# EAGLE design km11 (EAGLE 6.6.0)
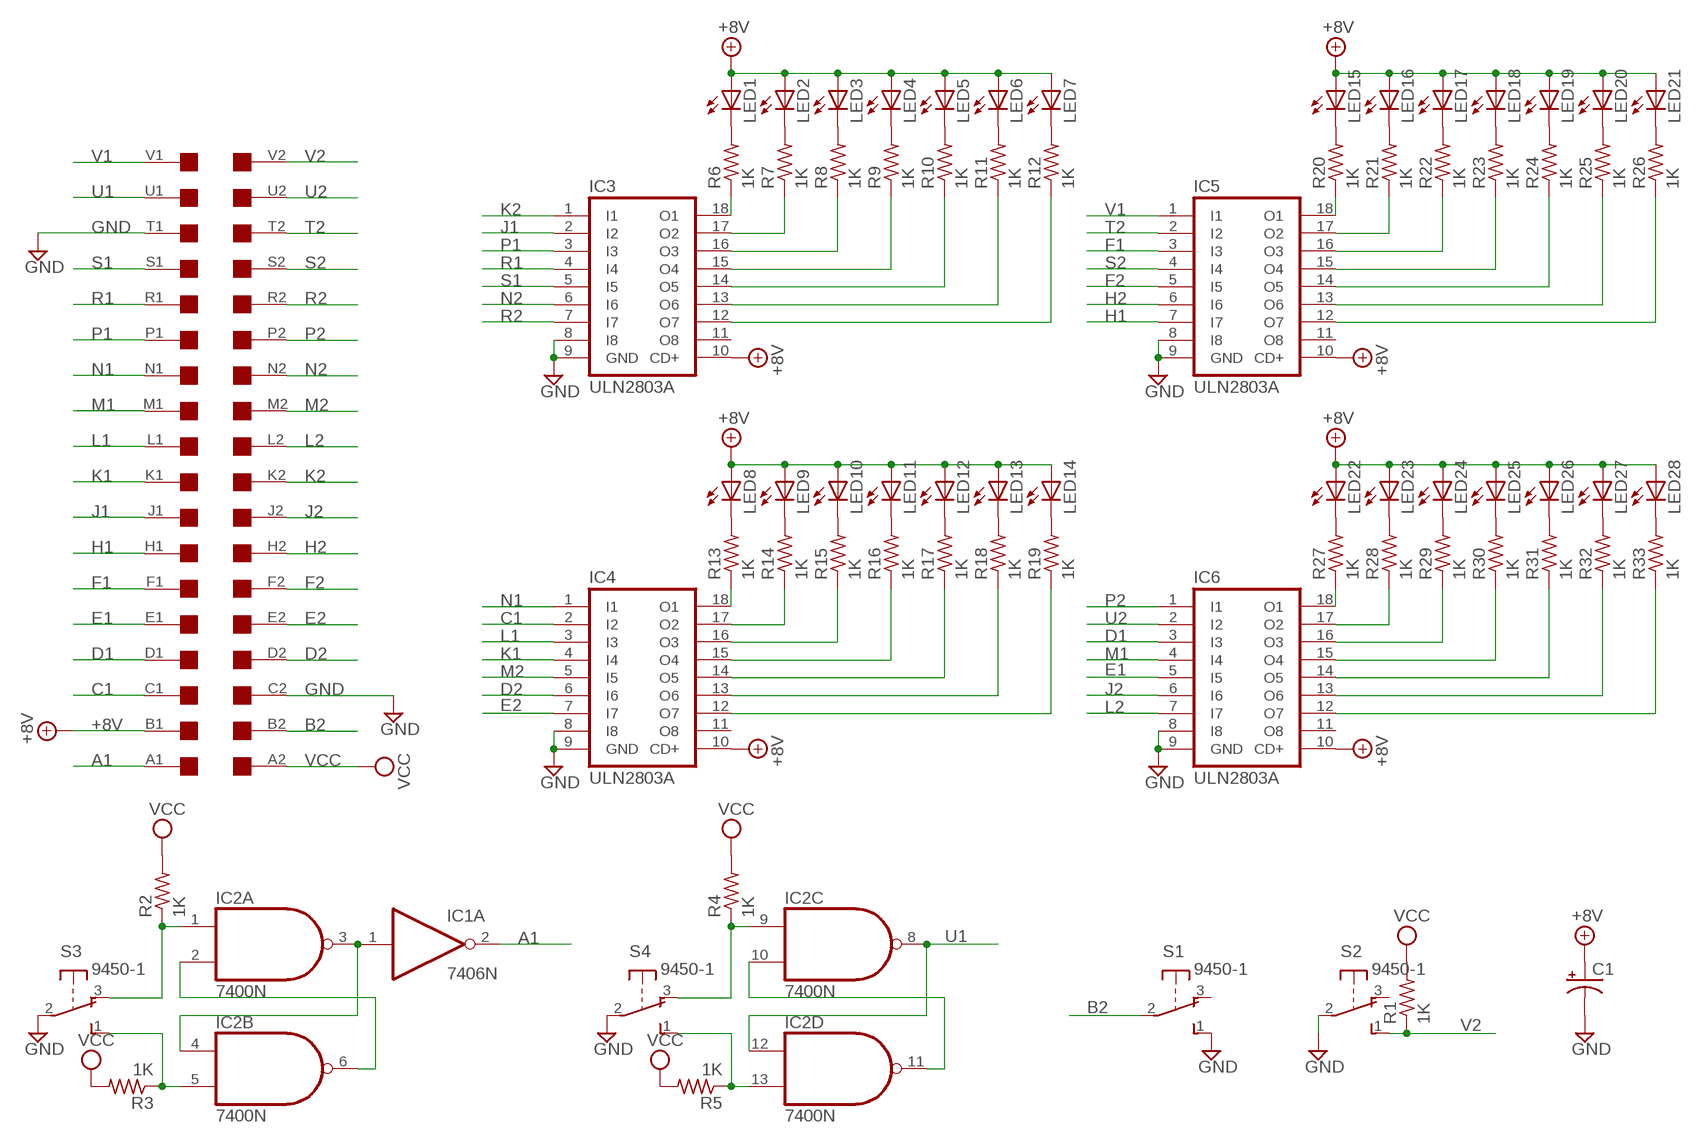
[diagram p0: schematic, sheet 1]

## Parts
C1  CPOL-USE22-6AXIAL  [E22-6]
IC1  7406N  [DIL14]
IC2  7400N  [DIL14]
IC3  ULN2803A  [DIL18]
IC4  ULN2803A  [DIL18]
IC5  ULN2803A  [DIL18]
IC6  ULN2803A  [DIL18]
LED1  LED3MM  [LED3MM]
LED2  LED3MM  [LED3MM]
LED3  LED3MM  [LED3MM]
LED4  LED3MM  [LED3MM]
LED5  LED3MM  [LED3MM]
LED6  LED3MM  [LED3MM]
LED7  LED3MM  [LED3MM]
LED8  LED3MM  [LED3MM]
LED9  LED3MM  [LED3MM]
LED10  LED3MM  [LED3MM]
LED11  LED3MM  [LED3MM]
LED12  LED3MM  [LED3MM]
LED13  LED3MM  [LED3MM]
LED14  LED3MM  [LED3MM]
LED15  LED3MM  [LED3MM]
LED16  LED3MM  [LED3MM]
LED17  LED3MM  [LED3MM]
LED18  LED3MM  [LED3MM]
LED19  LED3MM  [LED3MM]
LED20  LED3MM  [LED3MM]
LED21  LED3MM  [LED3MM]
LED22  LED3MM  [LED3MM]
LED23  LED3MM  [LED3MM]
LED24  LED3MM  [LED3MM]
LED25  LED3MM  [LED3MM]
LED26  LED3MM  [LED3MM]
LED27  LED3MM  [LED3MM]
LED28  LED3MM  [LED3MM]
R1  1K  R-US_0207/10  [0207/10]
R2  1K  R-US_0207/10  [0207/10]
R3  1K  R-US_0207/10  [0207/10]
R4  1K  R-US_0207/10  [0207/10]
R5  1K  R-US_0207/10  [0207/10]
R6  1K  R-US_0207/10  [0207/10]
R7  1K  R-US_0207/10  [0207/10]
R8  1K  R-US_0207/10  [0207/10]
R9  1K  R-US_0207/10  [0207/10]
R10  1K  R-US_0207/10  [0207/10]
R11  1K  R-US_0207/10  [0207/10]
R12  1K  R-US_0207/10  [0207/10]
R13  1K  R-US_0207/10  [0207/10]
R14  1K  R-US_0207/10  [0207/10]
R15  1K  R-US_0207/10  [0207/10]
R16  1K  R-US_0207/10  [0207/10]
R17  1K  R-US_0207/10  [0207/10]
R18  1K  R-US_0207/10  [0207/10]
R19  1K  R-US_0207/10  [0207/10]
R20  1K  R-US_0207/10  [0207/10]
R21  1K  R-US_0207/10  [0207/10]
R22  1K  R-US_0207/10  [0207/10]
R23  1K  R-US_0207/10  [0207/10]
R24  1K  R-US_0207/10  [0207/10]
R25  1K  R-US_0207/10  [0207/10]
R26  1K  R-US_0207/10  [0207/10]
R27  1K  R-US_0207/10  [0207/10]
R28  1K  R-US_0207/10  [0207/10]
R29  1K  R-US_0207/10  [0207/10]
R30  1K  R-US_0207/10  [0207/10]
R31  1K  R-US_0207/10  [0207/10]
R32  1K  R-US_0207/10  [0207/10]
R33  1K  R-US_0207/10  [0207/10]
S1  9450-1  [9450-1]
S2  9450-1  [9450-1]
S3  9450-1  [9450-1]
S4  9450-1  [9450-1]
U$1  EDGE-2CONNECTOR  [EDGE-CON2]

## Nets
+8V: C1.+ IC3.10(CD+) IC4.10(CD+) IC5.10(CD+) IC6.10(CD+) LED1.A LED2.A LED3.A LED4.A LED5.A LED6.A LED7.A LED8.A LED9.A LED10.A LED11.A LED12.A LED13.A LED14.A LED15.A LED16.A LED17.A LED18.A LED19.A LED20.A LED21.A LED22.A LED23.A LED24.A LED25.A LED26.A LED27.A LED28.A U$1.B1
A1: IC1.2(A:O) U$1.A1
B2: S1.2(P) U$1.B2
C1: IC4.2(I2) U$1.C1
D1: IC6.3(I3) U$1.D1
D2: IC4.6(I6) U$1.D2
E1: IC6.5(I5) U$1.E1
E2: IC4.7(I7) U$1.E2
F1: IC5.3(I3) U$1.F1
F2: IC5.5(I5) U$1.F2
GND: C1.- IC3.8(I8) IC3.9(GND) IC4.8(I8) IC4.9(GND) IC5.8(I8) IC5.9(GND) IC6.8(I8) IC6.9(GND) S1.1(S) S2.2(P) S3.2(P) S4.2(P) U$1.C2 U$1.T1
H1: IC5.7(I7) U$1.H1
H2: IC5.6(I6) U$1.H2
J1: IC3.2(I2) U$1.J1
J2: IC6.6(I6) U$1.J2
K1: IC4.4(I4) U$1.K1
K2: IC3.1(I1) U$1.K2
L1: IC4.3(I3) U$1.L1
L2: IC6.7(I7) U$1.L2
M1: IC6.4(I4) U$1.M1
M2: IC4.5(I5) U$1.M2
N1: IC4.1(I1) U$1.N1
N2: IC3.6(I6) U$1.N2
N$1: IC1.1(A:I) IC2.3(A:O) IC2.4(B:I0)
N$2: IC2.2(A:I1) IC2.6(B:O)
N$3: IC2.5(B:I1) R3.1 S3.1(S)
N$4: IC2.1(A:I0) R2.1 S3.3(O)
N$5: LED1.K(C) R6.2
N$6: IC2.10(C:I1) IC2.11(D:O)
N$7: IC2.13(D:I1) R5.1 S4.1(S)
N$8: IC2.9(C:I0) R4.1 S4.3(O)
N$9: IC3.18(O1) R6.1
N$10: LED2.K(C) R7.2
N$11: LED3.K(C) R8.2
N$12: LED4.K(C) R9.2
N$13: LED5.K(C) R10.2
N$14: LED6.K(C) R11.2
N$15: LED7.K(C) R12.2
N$16: IC3.17(O2) R7.1
N$17: IC3.16(O3) R8.1
N$18: IC3.15(O4) R9.1
N$19: IC3.14(O5) R10.1
N$20: IC3.13(O6) R11.1
N$21: IC3.12(O7) R12.1
N$29: LED8.K(C) R13.2
N$30: IC4.18(O1) R13.1
N$31: LED9.K(C) R14.2
N$32: LED10.K(C) R15.2
N$33: LED11.K(C) R16.2
N$34: LED12.K(C) R17.2
N$35: LED13.K(C) R18.2
N$36: LED14.K(C) R19.2
N$37: IC4.17(O2) R14.1
N$38: IC4.16(O3) R15.1
N$39: IC4.15(O4) R16.1
N$40: IC4.14(O5) R17.1
N$41: IC4.13(O6) R18.1
N$42: IC4.12(O7) R19.1
N$43: LED15.K(C) R20.2
N$44: IC5.18(O1) R20.1
N$45: LED16.K(C) R21.2
N$46: LED17.K(C) R22.2
N$47: LED18.K(C) R23.2
N$48: LED19.K(C) R24.2
N$49: LED20.K(C) R25.2
N$50: LED21.K(C) R26.2
N$51: IC5.17(O2) R21.1
N$52: IC5.16(O3) R22.1
N$53: IC5.15(O4) R23.1
N$54: IC5.14(O5) R24.1
N$55: IC5.13(O6) R25.1
N$56: IC5.12(O7) R26.1
N$57: LED22.K(C) R27.2
N$58: IC6.18(O1) R27.1
N$59: LED23.K(C) R28.2
N$60: LED24.K(C) R29.2
N$61: LED25.K(C) R30.2
N$62: LED26.K(C) R31.2
N$63: LED27.K(C) R32.2
N$64: LED28.K(C) R33.2
N$65: IC6.17(O2) R28.1
N$66: IC6.16(O3) R29.1
N$67: IC6.15(O4) R30.1
N$68: IC6.14(O5) R31.1
N$69: IC6.13(O6) R32.1
N$70: IC6.12(O7) R33.1
P1: IC3.3(I3) U$1.P1
P2: IC6.1(I1) U$1.P2
R1: IC3.4(I4) U$1.R1
R2: IC3.7(I7) U$1.R2
S1: IC3.5(I5) U$1.S1
S2: IC5.4(I4) U$1.S2
T2: IC5.2(I2) U$1.T2
U1: IC2.8(C:O) IC2.12(D:I0) U$1.U1
U2: IC6.2(I2) U$1.U2
V1: IC5.1(I1) U$1.V1
V2: R1.1 S2.1(S) U$1.V2
VCC: R1.2 R2.2 R3.2 R4.2 R5.2 U$1.A2
Unconnected: IC1.3(B:I) IC1.4(B:O) IC1.5(C:I) IC1.6(C:O) IC1.8(D:O) IC1.9(D:I) IC1.10(E:O) IC1.11(E:I) IC1.12(F:O) IC1.13(F:I) IC3.11(O8) IC4.11(O8) IC5.11(O8) IC6.11(O8) S1.3(O) S2.3(O)

## Power pins joined to a net without a drawn wire
GND: IC1.7(P:GND) IC2.7(P:GND)
VCC: IC1.14(P:VCC) IC2.14(P:VCC)

## Library data of the parts
C1 = rcl:CPOL-US: POLARIZED CAPACITOR, American symbol
IC1 = 74xx-us:74*06: Hex INVERTER, open collector high-voltage output
IC2 = 74xx-us:74*00: Quad 2-input NAND gate
IC3-IC6 = uln-udn:ULN2803A: DRIVER ARRAY
LED1-LED28 = led:LED: LED OSRAM: - CHIPLED LG R971, LG N971, LY N971, LG Q971, LY Q971, LO R971, LY R971 LH N974, LH R974 LS Q976, LO Q976, LY Q976 LO Q996 - Hyper CHIPLED LW Q18S LB Q993, LB Q99A, LB R99A - SideLED LS A670, LO A670, LY A670, LG A670, LP A670 LB A673, LV A673, LT A673, LW A673 LH A674 LY A675 LS A676, LA A676, LO A676, LY A676, LW A676 LS A679, LY A679, LG A679 - Hyper Micro SIDELED® LS Y876, LA Y876, LO Y876, LY Y876 LT Y87S - SmartLED LW L88C, LW L88S LB L89C, LB L89S, LG L890 LS L89K, LO L89K, LY L89K LS L896, LA L896, LO L896, LY L896 - TOPLED LS T670, LO T670, LY T670, LG T670, LP T670 LSG T670, LSP T670, LSY T670, LOP T670, LYG T670 LG T671, LOG T671, LSG T671 LB T673, LV T673, LT T673, LW T673 LH T674 LS T676, LA T676, LO T676, LY T676, LB T676, LH T676, LSB T676, LW T676 LB T67C, LV T67C, LT T67C, LS T67K, LO T67K, LY T67K, LW E67C LS E67B, LA E67B, LO E67B, LY E67B, LB E67C, LV E67C, LT E67C LW T67C LS T679, LY T679, LG T679 LS T770, LO T770, LY T770, LG T770, LP T770 LB T773, LV T773, LT T773, LW T773 LH T774 LS E675, LA E675, LY E675, LS T675 LS T776, LA T776, LO T776, LY T776, LB T776 LHGB T686 LT T68C, LB T68C - Hyper Mini TOPLED® LB M676 - Mini TOPLED Santana® LG M470 LS M47K, LO M47K, LY M47K Source: http://www.osram.convergy.de LUXEON: - LUMILED® LXK2-PW12-R00, LXK2-PW12-S00, LXK2-PW14-U00, LXK2-PW14-V00 LXK2-PM12-R00, LXK2-PM12-S00, LXK2-PM14-U00 LXK2-PE12-Q00, LXK2-PE12-R00, LXK2-PE12-S00, LXK2-PE14-T00, LXK2-PE14-U00 LXK2-PB12-K00, LXK2-PB12-L00, LXK2-PB12-M00, LXK2-PB14-N00, LXK2-PB14-P00, LXK2-PB14-Q00 LXK2-PR12-L00, LXK2-PR12-M00, LXK2-PR14-Q00, LXK2-PR14-R00 LXK2-PD12-Q00, LXK2-PD12-R00, LXK2-PD12-S00 LXK2-PH12-R00, LXK2-PH12-S00 LXK2-PL12-P00, LXK2-PL12-Q00, LXK2-PL12-R00 Source: www.luxeon.com KINGBRIGHT: KA-3528ASYC Source: www.kingbright.com
R1-R33 = rcl:R-US_: RESISTOR, American symbol
S1-S4 = switch-misc:9450-1: MARQUARDT SWITCH
U$1 = dec-con:EDGE-2: Double-Sided DEC edge connector.

## Board
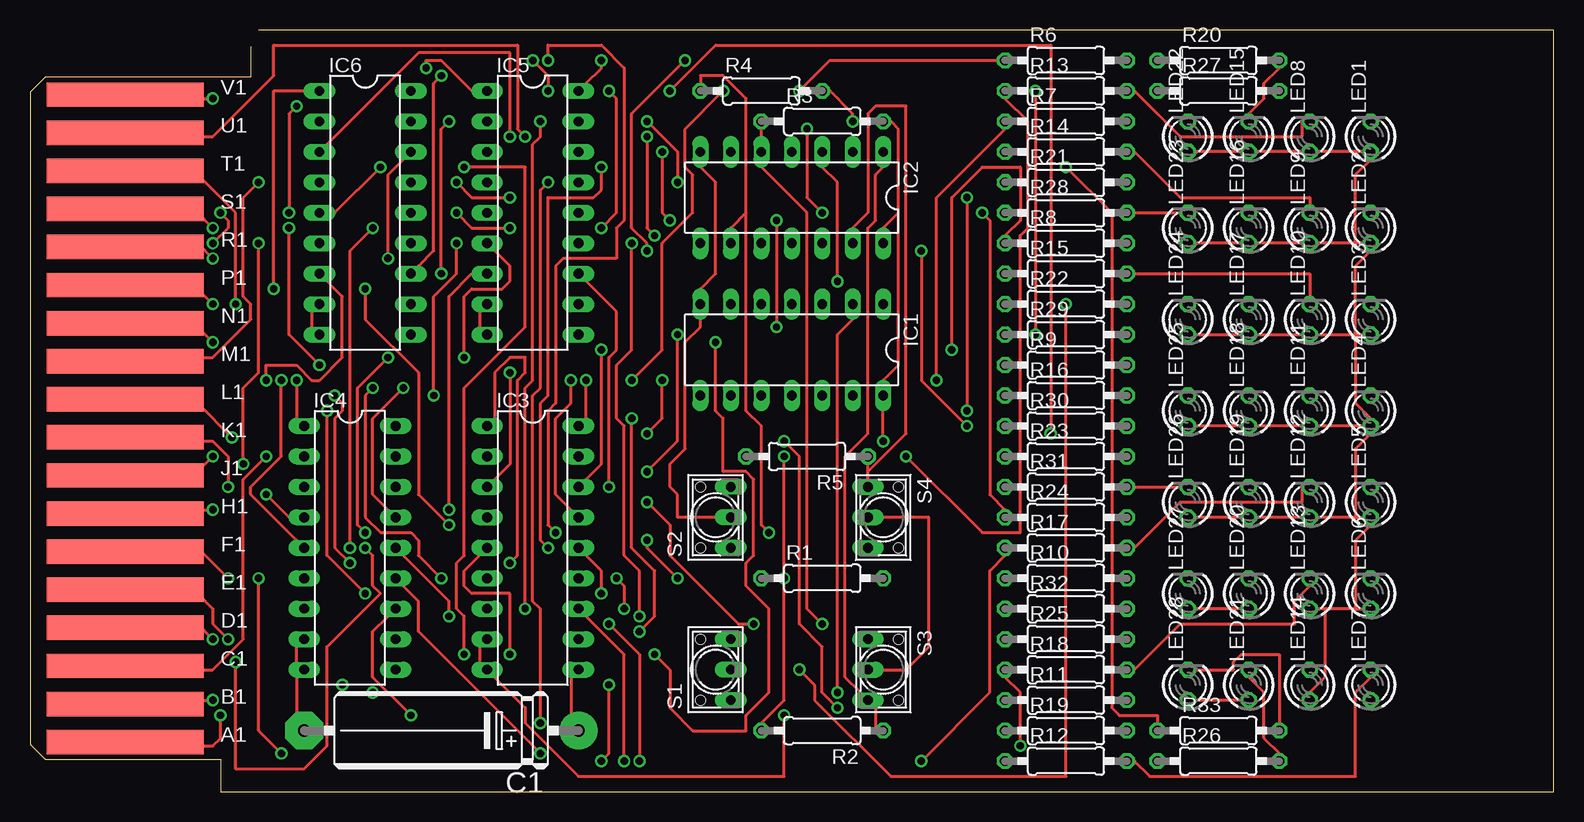
[diagram p1: board, top side]
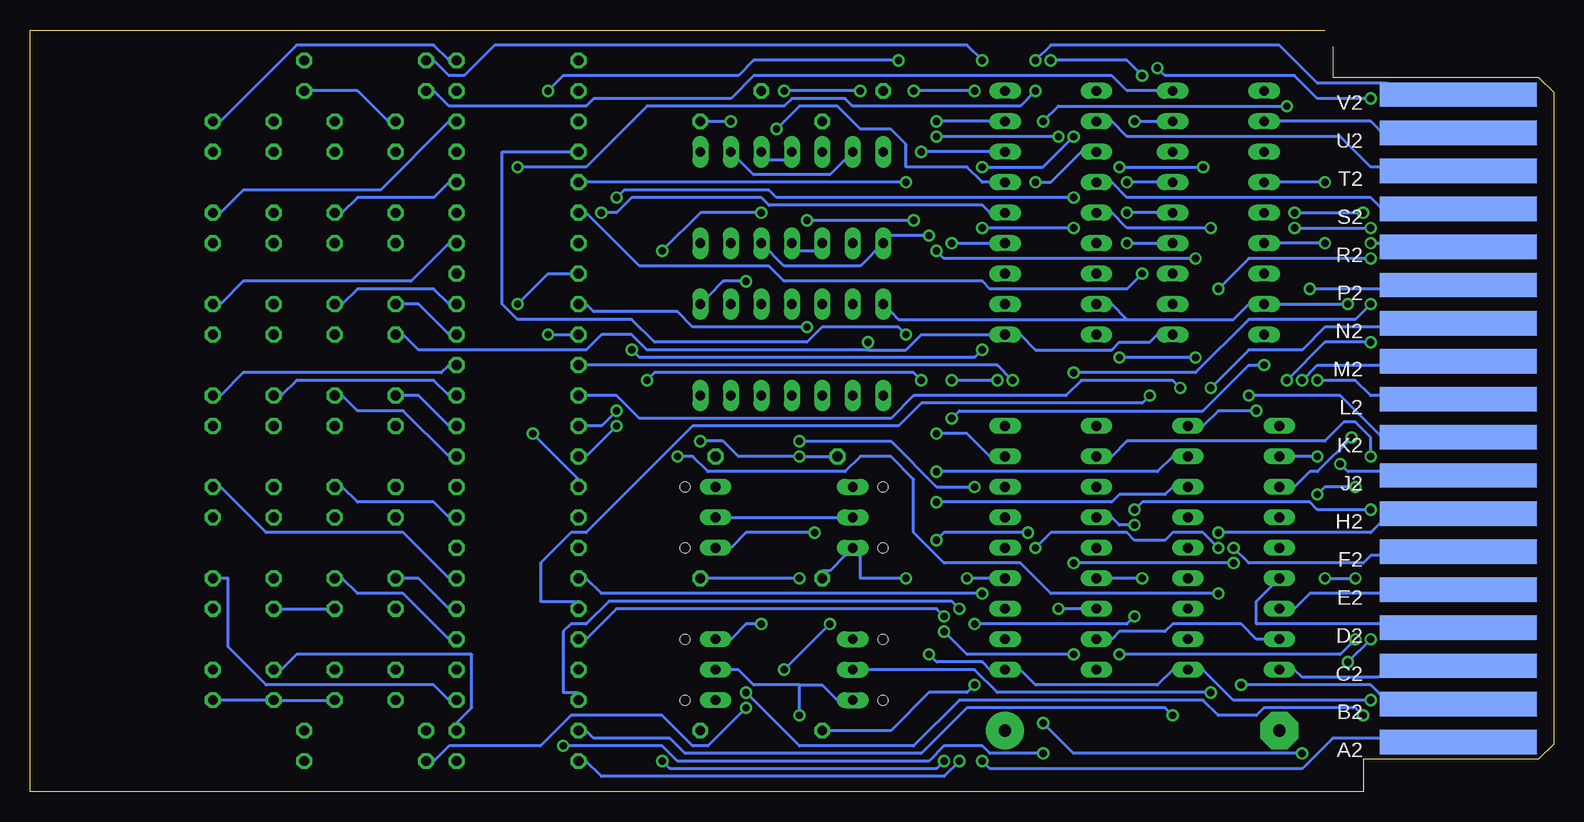
[diagram p2: board, bottom side, seen from below]

Size 127 x 63.5 mm. Coordinates in mm from the lower left corner, seen from the top.
Outline: 15.88,0 127,0 127,63.5 19.05,63.5
Copper layers (1*16): Top 0.035mm / dielectric 1.5mm / Bottom 0.035mm
Design rules "default *": minimum track width 10mil, minimum drill 24mil, track to track 8mil, track to pad 8mil, pad to pad 8mil, via to via 8mil, smd to smd 8mil, copper to edge 15mil, drill to drill 8mil, minimum pad ring 10mil, minimum via ring 8mil, stop-mask expansion 4mil, vias tented up to drill 0mil, thermal gap 10mil

### Footprints (pad centres in the part's own frame; a part is rotated, then mirrored left to right if it is on the bottom)
E22-6 = drill 1.016 pad 3.15: + -11.43,0 | drill 1.016 pad 3.15 octagon: - 11.43,0
DIL14 = drill 0.813 long: 1 -7.62,-3.81; 2 -5.08,-3.81; 3 -2.54,-3.81; 4 0,-3.81; 5 2.54,-3.81; 6 5.08,-3.81; 7 7.62,-3.81; 8 7.62,3.81; 9 5.08,3.81; 10 2.54,3.81; 11 0,3.81; 12 -2.54,3.81; 13 -5.08,3.81; 14 -7.62,3.81
DIL18 = drill 0.813 long: 1 -10.16,-3.81; 2 -7.62,-3.81; 3 -5.08,-3.81; 4 -2.54,-3.81; 5 0,-3.81; 6 2.54,-3.81; 7 5.08,-3.81; 8 7.62,-3.81; 9 10.16,-3.81; 10 10.16,3.81; 11 7.62,3.81; 12 5.08,3.81; 13 2.54,3.81; 14 0,3.81; 15 -2.54,3.81; 16 -5.08,3.81; 17 -7.62,3.81; 18 -10.16,3.81
LED3MM = drill 0.813 octagon: A -1.27,0; K 1.27,0
0207/10 = drill 0.813 octagon: 1 -5.08,0; 2 5.08,0
9450-1 = drill 0.813 long: 1 -2.54,-1.27; 2 0,-1.27; 3 2.54,-1.27 | hole 0.813: 2.54,1.27; -2.54,1.27
EDGE-CON2 = smd 13.106 x 2.032: A1 7.938,4.128; B1 7.938,7.303; C1 7.938,10.477; D1 7.938,13.652; E1 7.938,16.828; F1 7.938,20.003; H1 7.938,23.177; J1 7.938,26.352; K1 7.938,29.527; L1 7.938,32.703; M1 7.938,35.877; N1 7.938,39.053; P1 7.938,42.227; R1 7.938,45.403; S1 7.938,48.578; T1 7.938,51.752; U1 7.938,54.928; V1 7.938,58.102 | smd 13.106 x 2.032 bottom: A2 7.938,4.128; B2 7.938,7.303; C2 7.938,10.477; D2 7.938,13.652; E2 7.938,16.828; F2 7.938,20.003; H2 7.938,23.177; J2 7.938,26.352; K2 7.938,29.527; L2 7.938,32.703; M2 7.938,35.877; N2 7.938,39.053; P2 7.938,42.227; R2 7.938,45.403; S2 7.938,48.578; T2 7.938,51.752; U2 7.938,54.928; V2 7.938,58.102

### Placement (x,y rotation side)
C1  34.29,5.08 180 top
IC1  63.5,36.83 180 top
IC2  63.5,49.53 180 top
IC3  41.91,20.32 270 top
IC4  26.67,20.32 270 top
IC5  41.91,48.26 270 top
IC6  27.94,48.26 270 top
LED1  111.76,54.61 90 top
LED2  111.76,46.99 90 top
LED3  111.76,39.37 90 top
LED4  111.76,31.75 90 top
LED5  111.76,24.13 90 top
LED6  111.76,16.51 90 top
LED7  111.76,8.89 90 top
LED8  106.68,54.61 90 top
LED9  106.68,46.99 90 top
LED10  106.68,39.37 90 top
LED11  106.68,31.75 90 top
LED12  106.68,24.13 90 top
LED13  106.68,16.51 90 top
LED14  106.68,8.89 90 top
LED15  101.6,54.61 90 top
LED16  101.6,46.99 90 top
LED17  101.6,39.37 90 top
LED18  101.6,31.75 90 top
LED19  101.6,24.13 90 top
LED20  101.6,16.51 90 top
LED21  101.6,8.89 90 top
LED22  96.52,54.61 90 top
LED23  96.52,46.99 90 top
LED24  96.52,39.37 90 top
LED25  96.52,31.75 90 top
LED26  96.52,24.13 90 top
LED27  96.52,16.51 90 top
LED28  96.52,8.89 90 top
R1  66.04,17.78 0 top
R2  66.04,5.08 180 top
R3  66.04,55.88 0 top
R4  60.96,58.42 0 top
R5  64.77,27.94 180 top
R6  86.36,60.96 0 top
R7  86.36,55.88 0 top
R8  86.36,45.72 0 top
R9  86.36,35.56 0 top
R10  86.36,17.78 0 top
R11  86.36,7.62 0 top
R12  86.36,2.54 0 top
R13  86.36,58.42 0 top
R14  86.36,53.34 0 top
R15  86.36,43.18 0 top
R16  86.36,33.02 0 top
R17  86.36,20.32 0 top
R18  86.36,10.16 0 top
R19  86.36,5.08 0 top
R20  99.06,60.96 0 top
R21  86.36,50.8 0 top
R22  86.36,40.64 0 top
R23  86.36,27.94 0 top
R24  86.36,22.86 0 top
R25  86.36,12.7 0 top
R26  99.06,2.54 0 top
R27  99.06,58.42 0 top
R28  86.36,48.26 0 top
R29  86.36,38.1 0 top
R30  86.36,30.48 0 top
R31  86.36,25.4 0 top
R32  86.36,15.24 0 top
R33  99.06,5.08 0 top
S1  57.15,10.16 90 top
S2  57.15,22.86 90 top
S3  71.12,10.16 270 top
S4  71.12,22.86 270 top
U$1  0,0 0 top

### Tracks (layer width: path | path; a pad name or v marks a point on that pad's centre or on a via)
+8V  (via drill 0.61)
  Top 0.254: C1.+ 45.09,6.35 45.09,9.53 IC3.10 | v15.24,7.62 13.97,7.62 U$1.B1 | LED25.A 97.16,30.48 100.97,30.48 LED18.A 102.23,30.48 106.05,30.48 LED11.A 107.31,30.48 111.12,30.48 LED4.A | LED26.A 97.16,22.86 100.97,22.86 LED19.A 102.23,22.86 106.05,22.86 LED12.A 107.31,22.86 110.49,22.86 | 110.49,22.86 111.12,22.86 LED5.A 111.76,22.23 110.49,20.95 110.49,15.24 | LED28.A 97.16,7.62 100.97,7.62 LED21.A | LED27.A 97.16,15.24 100.97,15.24 LED20.A | 107.95,15.24 107.31,15.24 LED13.A | 110.49,15.24 107.95,15.24 | 110.49,15.24 111.12,15.24 LED6.A | 107.95,15.24 107.95,9.53 106.68,8.26 LED14.A | 110.49,22.86 110.49,28.57 111.76,29.84 LED4.A | LED22.A 97.16,53.34 100.97,53.34 LED15.A 102.23,53.34 106.05,53.34 LED8.A 107.31,53.34 111.12,53.34 LED1.A 111.76,52.7 110.49,51.44 110.49,45.72 | LED23.A 97.16,45.72 100.97,45.72 LED16.A 102.23,45.72 106.05,45.72 LED9.A 107.31,45.72 110.49,45.72 | 110.49,45.72 111.12,45.72 LED2.A 111.76,45.09 110.49,43.81 110.49,38.1 | LED24.A 97.16,38.1 100.97,38.1 LED17.A 102.23,38.1 106.05,38.1 LED10.A 107.31,38.1 110.49,38.1 | 110.49,38.1 111.12,38.1 LED3.A | 110.49,38.1 110.49,32.38 111.76,31.11 LED4.A | v52.07,11.43 53.34,10.16 53.34,6.99 55.24,5.08 59.69,5.08 59.69,6.35 61.59,8.26 61.59,15.24 59.69,17.14 59.69,19.05 60.33,19.68 60.33,26.04 59.69,26.67 57.78,26.67 57.78,31.11 57.15,31.75 v57.15,37.47
  Bottom 0.254: v15.24,7.62 26.67,7.62 29.21,10.16 IC4.10 31.75,10.16 33.02,8.89 43.18,8.89 44.45,10.16 IC3.10 46.99,10.16 47.62,10.79 51.44,10.79 v52.07,11.43 | LED21.A 102.23,7.62 106.05,7.62 LED14.A 107.31,7.62 111.12,7.62 LED7.A | LED13.A 106.05,15.24 102.23,15.24 LED20.A | IC6.10 33.02,38.1 33.66,37.47 36.2,37.47 36.83,36.83 43.18,36.83 44.45,38.1 IC5.10 46.99,38.1 52.7,38.1 53.98,36.83 57.15,36.83 | 57.15,36.83 75.56,36.83 76.83,38.1 79.38,38.1 80.64,36.83 94.61,36.83 95.89,38.1 LED24.A | v57.15,37.47 57.15,36.83
A1  (via drill 0.61)
  Top 0.254: v67.31,8.26 67.31,38.1 68.58,39.37 IC1.2 | v15.88,6.35 15.88,4.45 15.24,3.81 13.97,3.81 U$1.A1
  Bottom 0.254: v67.31,8.26 62.87,3.81 53.34,3.81 49.53,7.62 29.21,7.62 27.94,6.35 24.77,6.35 24.13,6.99 16.51,6.99 v15.88,6.35
B2  (via drill 0.61)
  Top 0.254: v28.57,8.26 26.04,8.26 v26.04,8.89
  Bottom 0.254: S1.2 48.26,10.16 46.35,8.26 v28.57,8.26 | v26.04,8.89 15.24,8.89 13.97,7.62 U$1.B2
C1  (via drill 0.61)
  Top 0.254: v19.68,27.94 17.78,26.04 17.78,12.7 15.24,10.16 12.7,10.16 U$1.C1
  Bottom 0.254: v19.68,27.94 IC4.2
D1  (via drill 0.61)
  Top 0.254: v40.01,54.61 40.01,61.59 32.38,61.59 24.77,53.98 IC6.3 | v47.62,52.07 47.62,50.16 46.99,49.53 43.18,49.53 43.18,33.02 42.55,32.38 42.55,20.95 v43.18,20.32 | v27.94,20.32 28.57,19.68 28.57,17.14 29.21,16.51 24.77,12.06 24.77,3.81 22.86,1.91 17.14,1.91 v17.14,10.79 | v15.24,12.7 13.97,13.97 U$1.D1
  Bottom 0.254: v40.01,54.61 42.55,52.07 v47.62,52.07 | v43.18,20.32 41.91,21.59 35.56,21.59 34.92,20.95 32.38,20.95 31.75,21.59 29.21,21.59 v27.94,20.32 | v17.14,10.79 v15.24,12.7
D2
  Bottom 0.254: IC4.6 23.5,17.14 24.77,15.88 24.77,13.97 13.97,13.97 U$1.D2
E1  (via drill 0.61)
  Top 0.254: v29.21,52.07 25.4,48.26 IC6.5 | v36.2,52.07 41.27,52.07 41.27,38.73 36.2,33.66 36.2,19.68 35.56,19.05 35.56,15.24 36.2,14.61 v36.2,11.43 | v16.51,12.7 15.24,13.97 15.24,15.24 13.97,16.51 U$1.E1
  Bottom 0.254: v36.2,52.07 v29.21,52.07 | v36.2,11.43 17.78,11.43 v16.51,12.7
E2
  Bottom 0.254: IC4.7 21.59,15.24 20.32,16.51 13.97,16.51 U$1.E2
F1  (via drill 0.61)
  Top 0.254: v43.18,50.8 42.55,50.16 42.55,33.66 41.91,33.02 41.91,15.88 42.55,15.24 v42.55,5.71 | v20.95,3.17 19.05,5.08 v19.05,17.78 | v16.51,17.78 13.97,20.32 U$1.F1
  Bottom 0.254: v43.18,50.8 41.91,50.8 39.37,53.34 IC5.3 | v42.55,5.71 40.01,3.17 v20.95,3.17 | v19.05,17.78 v16.51,17.78
F2  (via drill 0.61)
  Top 0.254: v28.57,46.99 26.67,45.09 v26.67,20.32
  Bottom 0.254: v28.57,46.99 35.56,46.99 36.83,48.26 IC5.5 | v26.67,20.32 25.4,19.05 15.88,19.05 15.24,19.68 13.97,19.68 U$1.F2
GND  (via drill 0.61)
  Top 0.254: IC3.8 37.47,12.06 37.47,10.79 IC3.9 38.73,9.53 41.27,6.99 41.27,5.71 45.72,1.27 62.87,1.27 v62.87,6.35 | IC4.8 22.23,12.06 22.23,10.79 IC4.9 22.23,9.53 22.23,6.35 C1.- | S4.2 71.12,22.86 74.93,22.86 74.93,12.06 73.03,10.16 71.12,10.16 S3.2 | IC2.7 55.88,52.07 57.15,50.8 57.15,43.18 55.88,41.91 IC1.7 55.88,39.37 55.88,38.73 54.61,37.47 54.61,28.57 53.34,27.3 53.34,25.4 53.98,24.77 53.98,22.86 57.15,22.86 S2.2 | IC6.9 23.5,38.73 23.5,40.01 IC6.8 | IC5.9 37.47,38.73 37.47,40.01 IC5.8 | v17.14,40.64 17.14,48.26 13.97,51.44 U$1.T1
  Bottom 0.254: IC3.8 36.83,12.7 36.2,13.34 32.38,13.34 31.75,13.97 26.04,13.97 24.77,12.7 24.13,12.7 IC4.8 | IC4.9 21.59,10.16 20.95,9.53 14.61,9.53 13.97,10.16 U$1.C2 | S2.2 59.69,22.86 68.58,22.86 S4.2 | 62.87,8.89 66.67,8.89 67.94,10.16 68.58,10.16 S3.2 | 62.87,8.89 60.96,8.89 59.69,7.62 S1.1 | 35.56,39.37 26.67,39.37 25.4,40.64 IC6.8 22.86,40.64 v17.14,40.64 | 35.56,39.37 36.83,40.64 IC5.8 | 35.56,39.37 54.61,39.37 55.24,40.01 IC1.7 | v62.87,6.35 62.87,8.89
H1  (via drill 0.61)
  Top 0.254: v34.92,23.5 34.92,41.27 36.83,43.18 IC5.7 | v15.24,23.5 13.97,23.5 U$1.H1
  Bottom 0.254: v34.92,23.5 34.29,24.13 20.32,24.13 19.68,23.5 v15.24,23.5
H2  (via drill 0.61)
  Top 0.254: v36.2,36.2 36.2,41.27 36.83,41.91 39.37,41.91 40.01,42.55 40.01,43.81 38.73,45.09 IC5.6 | v29.84,36.2 27.3,33.66 27.3,22.23 v27.94,21.59
  Bottom 0.254: v29.84,36.2 v36.2,36.2 | v27.94,21.59 15.24,21.59 13.97,22.86 U$1.H2
J1  (via drill 0.61)
  Top 0.254: v15.24,27.94 13.97,26.67 U$1.J1
  Bottom 0.254: v15.24,27.94 15.24,29.53 16.51,30.8 17.46,30.8 19.05,29.21 35.56,29.21 36.83,27.94 IC3.2
J2  (via drill 0.61)
  Top 0.254: v19.05,45.72 19.05,34.92 17.78,33.66 v17.78,27.3
  Bottom 0.254: v19.05,45.72 22.86,45.72 IC6.6 | v17.78,27.3 17.14,26.67 13.97,26.67 U$1.J2
K1  (via drill 0.61)
  Top 0.254: v19.68,24.77 21.59,22.86 IC4.4 | v16.51,25.4 16.51,27.94 15.24,29.21 13.97,29.21 U$1.K1
  Bottom 0.254: v19.68,24.77 19.05,25.4 v16.51,25.4
K2  (via drill 0.61)
  Top 0.254: v40.01,19.05 40.64,19.68 40.64,34.29 41.27,34.92 41.27,36.2 40.01,36.2 38.73,34.92 38.73,31.11 IC3.1 | v26.67,19.05 25.4,20.32 25.4,31.11 26.04,31.75 26.04,32.38 v25.4,33.02
  Bottom 0.254: v26.67,19.05 v40.01,19.05 | v25.4,33.02 17.78,33.02 13.97,29.21 U$1.K2
L1  (via drill 0.61)
  Top 0.254: v16.83,29.53 13.97,32.38 U$1.L1
  Bottom 0.254: v16.83,29.53 19.68,26.67 20.32,26.67 21.59,25.4 IC4.3
L2  (via drill 0.61)
  Top 0.254: IC6.7 26.04,41.27 26.04,36.2 24.13,34.29 23.5,34.29 22.23,35.56 19.68,35.56 v19.68,34.29
  Bottom 0.254: v19.68,34.29 16.51,34.29 15.24,33.02 13.97,33.02 U$1.L2
M1  (via drill 0.61)
  Top 0.254: v19.05,50.8 17.78,49.53 17.78,41.27 18.41,40.64 18.41,39.37 15.24,36.2 13.97,36.2 U$1.M1
  Bottom 0.254: v19.05,50.8 22.86,50.8 IC6.4
M2  (via drill 0.61)
  Top 0.254: v20.95,34.29 20.95,27.94 18.41,25.4 18.41,24.77 22.23,20.95 IC4.5
  Bottom 0.254: v20.95,34.29 19.68,35.56 13.97,35.56 U$1.M2
N1  (via drill 0.61)
  Top 0.254: v22.23,34.29 22.23,31.11 IC4.1 | v15.24,37.47 13.97,38.73 U$1.N1
  Bottom 0.254: v22.23,34.29 19.05,37.47 v15.24,37.47
N2  (via drill 0.61)
  Top 0.254: v34.29,17.78 32.38,19.68 32.38,20.95 31.75,21.59 29.21,21.59 27.94,22.86 27.94,33.02 v28.57,33.66
  Bottom 0.254: v34.29,17.78 36.83,17.78 IC3.6 | v28.57,33.66 25.4,36.83 20.95,36.83 19.05,38.73 13.97,38.73 U$1.N2
N$1  (via drill 0.61)
  Top 0.254: v67.31,42.55 67.31,50.8 66.04,52.07 IC2.3
  Bottom 0.254: IC2.4 64.14,52.7 65.41,52.7 IC2.3 | v67.31,42.55 69.22,42.55 70.48,41.27 IC1.1
N$2
  Bottom 0.254: IC2.6 59.05,52.7 60.33,51.44 66.67,51.44 67.94,52.7 IC2.2
N$3  (via drill 0.61)
  Top 0.254: R3.1 60.96,55.24 60.96,54.61 IC2.5 60.96,52.07 64.77,48.26 64.77,15.24 v66.04,13.97
  Bottom 0.254: v66.04,13.97 67.31,13.97 68.58,12.7 S3.1
N$4
  Top 0.254: R2.1 70.48,5.08 70.48,6.99 S3.3 69.22,8.26 67.94,9.53 67.94,27.94 69.85,29.84 69.85,46.99 70.48,47.62 70.48,51.44 71.12,52.07 IC2.1
N$5
  Bottom 0.254: R6.2 92.08,60.96 93.34,62.23 104.78,62.23 111.12,55.88 LED1.K
N$6
  Bottom 0.254: IC2.10 61.59,45.09 62.87,45.09 IC2.11
N$7
  Top 0.254: 69.85,26.67 69.85,27.3 R5.1 | 69.85,26.67 69.85,26.04 S4.1 | 69.85,26.67 73.03,29.84 73.03,57.15 70.48,57.15 69.85,56.52 69.85,48.26 68.58,46.99 IC2.13
N$8  (via drill 0.61)
  Top 0.254: 59.69,48.26 58.42,46.99 IC2.9 | 59.69,48.26 59.69,57.78 57.78,59.69 55.88,59.69 55.88,59.05 R4.1 | v61.59,21.59 60.96,22.23 60.96,30.48 59.69,31.75 59.69,48.26
  Bottom 0.254: v61.59,21.59 67.31,21.59 68.58,20.32 S4.3
N$9  (via drill 0.61)
  Top 0.254: v46.35,34.29 46.35,31.11 IC3.18 | v50.16,34.29 52.7,36.83 52.7,45.72 55.24,48.26 55.24,51.44 54.61,52.07 54.61,55.24 v57.78,58.42 | v64.14,58.42 66.67,60.96 80.64,60.96 R6.1
  Bottom 0.254: v46.35,34.29 v50.16,34.29 | v57.78,58.42 v64.14,58.42
N$10
  Bottom 0.254: R7.2 92.08,55.88 97.79,50.16 109.22,50.16 111.12,48.26 LED2.K
N$11
  Bottom 0.254: R8.2 92.08,45.72 95.25,42.55 109.22,42.55 111.12,40.64 LED3.K
N$12
  Bottom 0.254: R9.2 92.08,35.56 92.71,34.92 109.22,34.92 111.12,33.02 LED4.K
N$13
  Bottom 0.254: R10.2 92.08,17.78 95.89,21.59 107.31,21.59 111.12,25.4 LED5.K
N$14
  Bottom 0.254: R11.2 92.08,7.62 93.34,8.89 107.31,8.89 110.49,12.06 110.49,17.78 111.12,17.78 LED6.K
N$15
  Top 0.254: R12.2 92.08,2.54 93.34,1.27 110.49,1.27 110.49,8.26 111.76,9.53 LED7.K
N$16  (via drill 0.61)
  Top 0.254: v51.44,29.84 52.7,31.11 v52.7,34.29 | v75.56,34.29 75.56,49.53 81.28,55.24 R7.1
  Bottom 0.254: v51.44,29.84 48.9,29.84 46.99,27.94 IC3.17 | v52.7,34.29 53.34,34.92 74.93,34.92 v75.56,34.29
N$17  (via drill 0.61)
  Top 0.254: v47.62,36.83 47.62,27.3 46.35,26.04 IC3.16 | v76.83,36.83 76.83,49.53 79.38,52.07 82.55,52.07 82.55,47.62 81.28,46.35 R8.1
  Bottom 0.254: v47.62,36.83 48.26,36.2 76.2,36.2 v76.83,36.83
N$18  (via drill 0.61)
  Top 0.254: v45.09,34.29 45.09,32.38 43.81,31.11 43.81,24.77 45.09,23.5 IC3.15
  Bottom 0.254: v45.09,34.29 46.35,35.56 80.64,35.56 R9.1
N$19  (via drill 0.61)
  Top 0.254: v47.62,16.51 47.62,18.41 46.35,19.68 IC3.14
  Bottom 0.254: v47.62,16.51 79.38,16.51 80.64,17.78 R10.1
N$20  (via drill 0.61)
  Top 0.254: v48.9,17.78 49.53,17.14 v49.53,15.24
  Bottom 0.254: v48.9,17.78 46.99,17.78 IC3.13 | v49.53,15.24 50.16,15.88 78.74,15.88 80.64,13.97 81.92,13.97 82.55,13.34 82.55,8.26 81.28,8.26 R11.1
N$21  (via drill 0.61)
  Top 0.254: v49.53,2.54 49.53,11.43 46.35,14.61 IC3.12
  Bottom 0.254: v49.53,2.54 50.8,1.27 79.38,1.27 80.64,2.54 R12.1
N$29
  Top 0.254: R13.2 92.08,58.42 95.89,54.61 106.05,54.61 106.05,55.88 LED8.K
N$30  (via drill 0.61)
  Top 0.254: v24.77,31.75 24.77,19.68 v27.94,16.51 | v73.03,27.94 79.38,21.59 82.55,21.59 82.55,46.35 83.19,46.99 83.19,55.88 81.28,57.78 R13.1
  Bottom 0.254: v24.77,31.75 27.94,31.75 29.21,30.48 IC4.18 | v27.94,16.51 41.91,16.51 44.45,19.05 50.8,19.05 53.34,21.59 53.34,26.04 55.24,27.94 57.78,27.94 59.05,26.67 70.48,26.67 71.75,27.94 v73.03,27.94
N$31
  Top 0.254: R14.2 92.08,53.34 95.89,49.53 106.68,49.53 106.68,48.9 LED9.K
N$32
  Top 0.254: R15.2 92.08,43.18 106.68,43.18 106.68,41.27 LED10.K
N$33
  Bottom 0.254: R16.2 92.08,33.02 93.34,34.29 104.78,34.29 106.05,33.02 LED11.K
N$34
  Top 0.254: R17.2 92.08,20.32 95.89,24.13 106.05,24.13 106.05,25.4 LED12.K
N$35
  Top 0.254: R18.2 92.08,10.16 95.89,13.97 105.41,13.97 105.41,15.88 106.68,17.14 LED13.K
N$36
  Bottom 0.254: R19.2 91.44,5.71 90.17,6.99 90.17,11.43 104.78,11.43 106.05,10.16 LED14.K
N$37  (via drill 0.61)
  Top 0.254: v51.44,26.67 53.98,29.21 v53.98,38.1
  Bottom 0.254: v51.44,26.67 33.02,26.67 31.75,27.94 IC4.17 | v53.98,38.1 54.61,38.73 60.96,38.73 62.23,37.47 74.93,37.47 76.83,39.37 86.36,39.37 87.63,40.64 87.63,53.34 81.92,53.34 R14.1
N$38  (via drill 0.61)
  Top 0.254: v51.44,24.13 53.34,22.23 53.34,19.68 59.05,13.97 v60.33,13.97 | v64.14,10.16 65.41,8.89 65.41,7.62 71.75,1.27 86.36,1.27 v86.36,40.64
  Bottom 0.254: v51.44,24.13 36.83,24.13 36.2,24.77 32.38,24.77 31.75,25.4 IC4.16 | v60.33,13.97 v64.14,10.16 | v86.36,40.64 83.82,43.18 81.92,43.18 R15.1
N$39  (via drill 0.61)
  Top 0.254: v31.11,33.66 28.57,31.11 28.57,24.77 29.84,23.5 IC4.15
  Bottom 0.254: v31.11,33.66 31.75,34.29 39.37,34.29 40.64,33.02 53.34,33.02 55.24,31.11 76.2,31.11 78.11,33.02 80.64,33.02 R16.1
N$40  (via drill 0.61)
  Top 0.254: v34.92,14.61 34.92,15.88 31.11,19.68 IC4.14 | v48.26,13.97 50.8,11.43 v50.8,2.54 | v74.3,2.54 80.01,8.26 80.01,18.41 81.28,19.68 R17.1
  Bottom 0.254: v34.92,14.61 35.56,13.97 v48.26,13.97 | v50.8,2.54 51.44,1.91 73.66,1.91 v74.3,2.54
N$41  (via drill 0.61)
  Top 0.254: v82.55,3.81 82.55,8.26 81.28,9.53 R18.1 | v42.55,3.17 32.38,13.34 32.38,15.88 31.11,17.14 IC4.13
  Bottom 0.254: v82.55,3.81 74.3,3.81 73.03,2.54 52.07,2.54 50.8,3.81 47.62,3.81 46.99,3.17 v42.55,3.17
N$42  (via drill 0.61)
  Top 0.254: v31.75,6.35 28.57,9.53 28.57,13.34 29.84,14.61 IC4.12
  Bottom 0.254: v31.75,6.35 32.38,6.99 48.9,6.99 52.7,3.17 72.39,3.17 73.66,4.45 80.01,4.45 80.64,5.08 R19.1
N$43
  Top 0.254: LED15.K 101.6,56.52 102.87,57.78 102.87,59.05 104.14,60.33 R20.2
N$44  (via drill 0.61)
  Top 0.254: v47.62,60.96 47.62,60.33 46.35,59.05 IC5.18
  Bottom 0.254: v47.62,60.96 48.9,62.23 88.27,62.23 90.81,59.69 92.08,59.69 93.34,60.96 R20.1
N$45
  Bottom 0.254: R21.2 92.08,50.8 93.34,49.53 99.69,49.53 100.97,48.26 LED16.K
N$46
  Bottom 0.254: R22.2 92.08,40.64 93.34,41.91 99.69,41.91 100.97,40.64 LED17.K
N$47
  Bottom 0.254: R23.2 92.08,27.94 95.89,31.75 99.69,31.75 100.97,33.02 LED18.K
N$48
  Bottom 0.254: R24.2 92.08,22.86 93.34,24.13 99.69,24.13 100.97,25.4 LED19.K
N$49
  Bottom 0.254: R25.2 92.08,12.7 95.89,16.51 99.69,16.51 100.97,17.78 LED20.K
N$50
  Top 0.254: R26.2 104.14,3.17 102.87,4.45 102.87,8.26 101.6,9.53 LED21.K
N$51  (via drill 0.61)
  Top 0.254: v51.44,55.88 53.98,53.34 v53.98,50.8
  Bottom 0.254: v51.44,55.88 46.99,55.88 IC5.17 | v53.98,50.8 80.64,50.8 R21.1
N$52  (via drill 0.61)
  Top 0.254: v62.23,47.62 v62.23,38.73 | v53.34,47.62 52.7,48.26 v52.7,53.34
  Bottom 0.254: v62.23,38.73 71.75,38.73 73.03,40.01 80.01,40.01 80.64,40.64 R22.1 | v53.34,47.62 v62.23,47.62 | v52.7,53.34 46.99,53.34 IC5.16
N$53  (via drill 0.61)
  Top 0.254: v78.11,30.48 74.3,34.29 v74.3,45.09 | v66.04,48.26 64.77,49.53 v64.77,55.24
  Bottom 0.254: v78.11,30.48 80.64,27.94 R23.1 | v74.3,45.09 71.12,48.26 v66.04,48.26 | v64.77,55.24 62.87,57.15 59.69,57.15 57.78,55.24 55.24,55.24 53.98,53.98 53.98,52.07 48.9,52.07 47.62,50.8 46.99,50.8 IC5.15
N$54  (via drill 0.61)
  Top 0.254: v79.38,48.26 80.01,47.62 80.01,24.77 81.28,23.5 R24.1
  Bottom 0.254: v79.38,48.26 78.11,48.26 76.83,49.53 66.04,49.53 65.41,48.9 47.62,48.9 46.99,48.26 IC5.14
N$55  (via drill 0.61)
  Top 0.254: v50.8,14.61 50.8,18.41 49.53,19.68 49.53,30.48 48.9,31.11 48.9,35.56 50.16,36.83 v50.16,45.72
  Bottom 0.254: v50.8,14.61 51.44,15.24 78.11,15.24 80.64,12.7 R25.1 | v50.16,45.72 46.99,45.72 IC5.13
N$56  (via drill 0.61)
  Top 0.254: v67.31,6.99 66.04,8.26 66.04,12.06 64.14,13.97 64.14,27.94 v62.87,29.21 | v48.26,25.4 48.26,36.2 48.9,36.83 48.9,40.01 46.35,42.55 IC5.12
  Bottom 0.254: v67.31,6.99 70.48,3.81 71.75,3.81 74.3,6.35 81.92,6.35 84.45,3.81 92.08,3.81 93.34,2.54 R26.1 | v62.87,29.21 55.24,29.21 51.44,25.4 v48.26,25.4
N$57
  Bottom 0.254: LED22.K 97.16,55.88 99.69,58.42 103.5,58.42 R27.2
N$58
  Bottom 0.254: IC6.18 33.02,58.42 35.56,58.42 36.83,59.69 66.67,59.69 68.58,57.78 80.01,57.78 80.64,57.15 92.08,57.15 93.34,58.42 R27.1
N$59
  Top 0.254: R28.2 92.08,48.26 95.89,48.26 LED23.K
N$60
  Bottom 0.254: R29.2 92.08,38.1 94.61,40.64 95.89,40.64 LED24.K
N$61
  Bottom 0.254: R30.2 92.08,30.48 94.61,33.02 95.89,33.02 LED25.K
N$62
  Top 0.254: R31.2 92.08,25.4 95.89,25.4 LED26.K
N$63
  Bottom 0.254: R32.2 92.08,15.24 94.61,17.78 95.89,17.78 LED27.K
N$64
  Top 0.254: LED28.K 97.16,10.16 100.33,10.16 100.33,10.79 100.97,11.43 104.14,11.43 104.14,5.71 R33.2
N$65  (via drill 0.61)
  Top 0.254: v34.29,43.18 34.29,55.24 v34.92,55.88
  Bottom 0.254: v34.29,43.18 35.56,41.91 46.99,41.91 47.62,42.55 64.14,42.55 65.41,43.81 76.2,43.81 80.64,48.26 R28.1 | v34.92,55.88 33.02,55.88 IC6.17
N$66  (via drill 0.61)
  Top 0.254: v83.82,58.42 v83.82,38.1 | v54.61,60.96 50.16,56.52 50.16,46.99 51.44,45.72 v51.44,45.09 | v29.84,44.45 29.84,51.44 31.11,52.7 IC6.16
  Bottom 0.254: v83.82,38.1 81.92,38.1 R29.1 | v83.82,58.42 82.55,59.69 67.94,59.69 66.67,60.96 v54.61,60.96 | v51.44,45.09 50.8,44.45 v29.84,44.45
N$67  (via drill 0.61)
  Top 0.254: v35.56,50.8 36.83,49.53 v40.01,49.53 | v78.11,49.53 v78.11,31.75
  Bottom 0.254: v35.56,50.8 33.02,50.8 IC6.15 | v40.01,49.53 64.77,49.53 65.41,50.16 77.47,50.16 v78.11,49.53 | v78.11,31.75 79.38,30.48 80.64,30.48 R30.1
N$68  (via drill 0.61)
  Top 0.254: v35.56,48.26 36.83,46.99 v40.01,46.99 | v47.62,46.99 48.9,48.26 48.9,57.78 v48.26,58.42 | v53.34,58.42 57.15,62.23 85.09,62.23 v85.09,29.84
  Bottom 0.254: v35.56,48.26 33.02,48.26 IC6.14 | v40.01,46.99 v47.62,46.99 | v48.26,58.42 v53.34,58.42 | v85.09,29.84 81.28,26.04 R31.1
N$69  (via drill 0.61)
  Top 0.254: v35.56,45.72 35.56,43.18 33.66,41.27 v33.66,33.02
  Bottom 0.254: v35.56,45.72 33.02,45.72 IC6.13 | v33.66,33.02 34.29,32.38 52.7,32.38 54.61,30.48 71.75,30.48 80.64,21.59 81.92,21.59 84.45,19.05 84.45,15.88 81.28,15.88 R32.1
N$70  (via drill 0.61)
  Top 0.254: v34.29,59.69 33.66,59.05 33.66,45.09 32.38,43.81 IC6.12 | v41.91,60.96 43.18,59.69 v43.18,58.42 | v86.36,52.07 90.17,48.26 90.17,6.99 90.81,6.35 93.98,6.35 93.98,5.71 R33.1
  Bottom 0.254: v34.29,59.69 35.56,60.96 v41.91,60.96 | v43.18,58.42 44.45,57.15 58.42,57.15 59.05,57.78 63.5,57.78 64.14,57.15 75.56,57.15 80.64,52.07 v86.36,52.07
P1  (via drill 0.61)
  Top 0.254: v40.01,34.92 40.01,27.3 38.73,26.04 IC3.3 | v15.24,40.64 13.97,41.91 U$1.P1
  Bottom 0.254: v40.01,34.92 29.84,34.92 25.4,39.37 16.51,39.37 v15.24,40.64
P2  (via drill 0.61)
  Top 0.254: IC6.1 20.32,58.42 v20.32,41.91
  Bottom 0.254: v20.32,41.91 13.97,41.91 U$1.P2
R1  (via drill 0.61)
  Top 0.254: v34.92,22.23 32.38,24.77 32.38,34.92 27.94,39.37 v27.94,41.91 | v15.24,44.45 13.97,45.72 U$1.R1
  Bottom 0.254: v34.92,22.23 36.2,22.23 36.83,22.86 IC3.4 | v27.94,41.91 25.4,44.45 v15.24,44.45
R2  (via drill 0.61)
  Top 0.254: v41.27,15.24 41.27,33.66 41.91,34.29 41.91,53.98 42.55,54.61 v42.55,55.88 | v22.23,57.15 21.59,56.52 v21.59,48.26 | v15.88,48.26 16.51,47.62 16.51,46.99 v15.24,45.72
  Bottom 0.254: v41.27,15.24 39.37,15.24 IC3.7 | v42.55,55.88 41.27,57.15 v22.23,57.15 | v21.59,48.26 v15.88,48.26 | v15.24,45.72 13.97,45.72 U$1.R2
S1  (via drill 0.61)
  Top 0.254: v40.01,11.43 40.01,16.51 36.83,16.51 36.2,17.14 36.2,18.41 37.47,19.68 IC3.5 | v50.8,13.34 52.07,14.61 52.07,18.41 50.16,20.32 v50.16,31.11 | v24.13,35.56 21.59,38.1 v21.59,46.99 | v15.24,46.99 13.97,48.26 U$1.S1
  Bottom 0.254: v40.01,11.43 48.9,11.43 v50.8,13.34 | v50.16,31.11 49.53,31.75 29.21,31.75 25.4,35.56 v24.13,35.56 | v21.59,46.99 v15.24,46.99
S2
  Bottom 0.254: IC5.4 36.83,50.8 35.56,49.53 15.24,49.53 13.97,48.26 U$1.S2
T2
  Bottom 0.254: IC5.2 36.83,55.88 35.56,54.61 17.78,54.61 15.88,52.7 15.24,52.07 13.97,52.07 U$1.T2
U1  (via drill 0.61)
  Top 0.254: v52.07,46.35 51.44,46.99 v51.44,54.61 | v41.27,54.61 40.64,55.24 40.64,62.23 20.32,62.23 20.32,59.69 15.24,54.61 13.97,54.61 U$1.U1
  Bottom 0.254: IC2.12 64.14,43.81 57.78,43.81 IC2.8 55.24,46.35 v52.07,46.35 | v41.27,54.61 v51.44,54.61
U2
  Bottom 0.254: IC6.2 15.24,55.88 13.97,54.61 U$1.U2
V1  (via drill 0.61)
  Top 0.254: v33.02,60.33 33.02,60.96 34.29,60.96 36.83,58.42 IC5.1 | v15.24,57.78 13.97,57.78 U$1.V1
  Bottom 0.254: v33.02,60.33 32.38,59.69 21.59,59.69 19.68,57.78 v15.24,57.78
V2  (via drill 0.61)
  Top 0.254: v53.98,17.78 51.44,20.32 v51.44,20.95 | v43.81,21.59 43.18,22.23 43.18,31.75 43.81,32.38 43.81,43.81 44.45,44.45 48.9,44.45 48.9,46.99 49.53,47.62 49.53,60.33 47.62,62.23 43.18,62.23 v43.18,60.96
  Bottom 0.254: R1.1 60.96,18.41 60.33,18.41 59.05,19.68 S2.1 57.78,19.68 57.78,17.78 v53.98,17.78 | v51.44,20.95 50.8,21.59 v43.81,21.59 | v43.18,60.96 41.91,62.23 22.86,62.23 19.68,59.05 13.97,59.05 U$1.V2
VCC  (via drill 0.61)
  Top 0.254: R2.2 60.96,5.71 62.87,7.62 v62.87,17.78 v62.87,27.94 | v71.12,29.21 71.12,31.75 IC1.14 71.12,34.29 72.39,35.56 72.39,48.26 | 72.39,48.26 71.12,46.99 IC2.14 | 72.39,48.26 72.39,55.24 71.75,55.88 R3.2 | v68.58,55.88 68.58,56.52 66.67,58.42 R4.2 | v47.62,2.54 48.26,3.17 v48.26,8.89
  Bottom 0.254: v62.87,17.78 70.48,17.78 R1.2 | v71.12,29.21 69.22,29.21 67.94,27.94 v62.87,27.94 60.33,27.94 R5.2 | v68.58,55.88 70.48,55.88 R3.2 | v47.62,2.54 46.99,1.91 20.95,1.91 18.41,4.45 14.61,4.45 U$1.A2 | v48.26,8.89 48.9,8.26 52.07,8.26 55.24,5.08 60.33,5.08 R2.2